# EAGLE design CLK_1_1 (EAGLE 8.3.2)
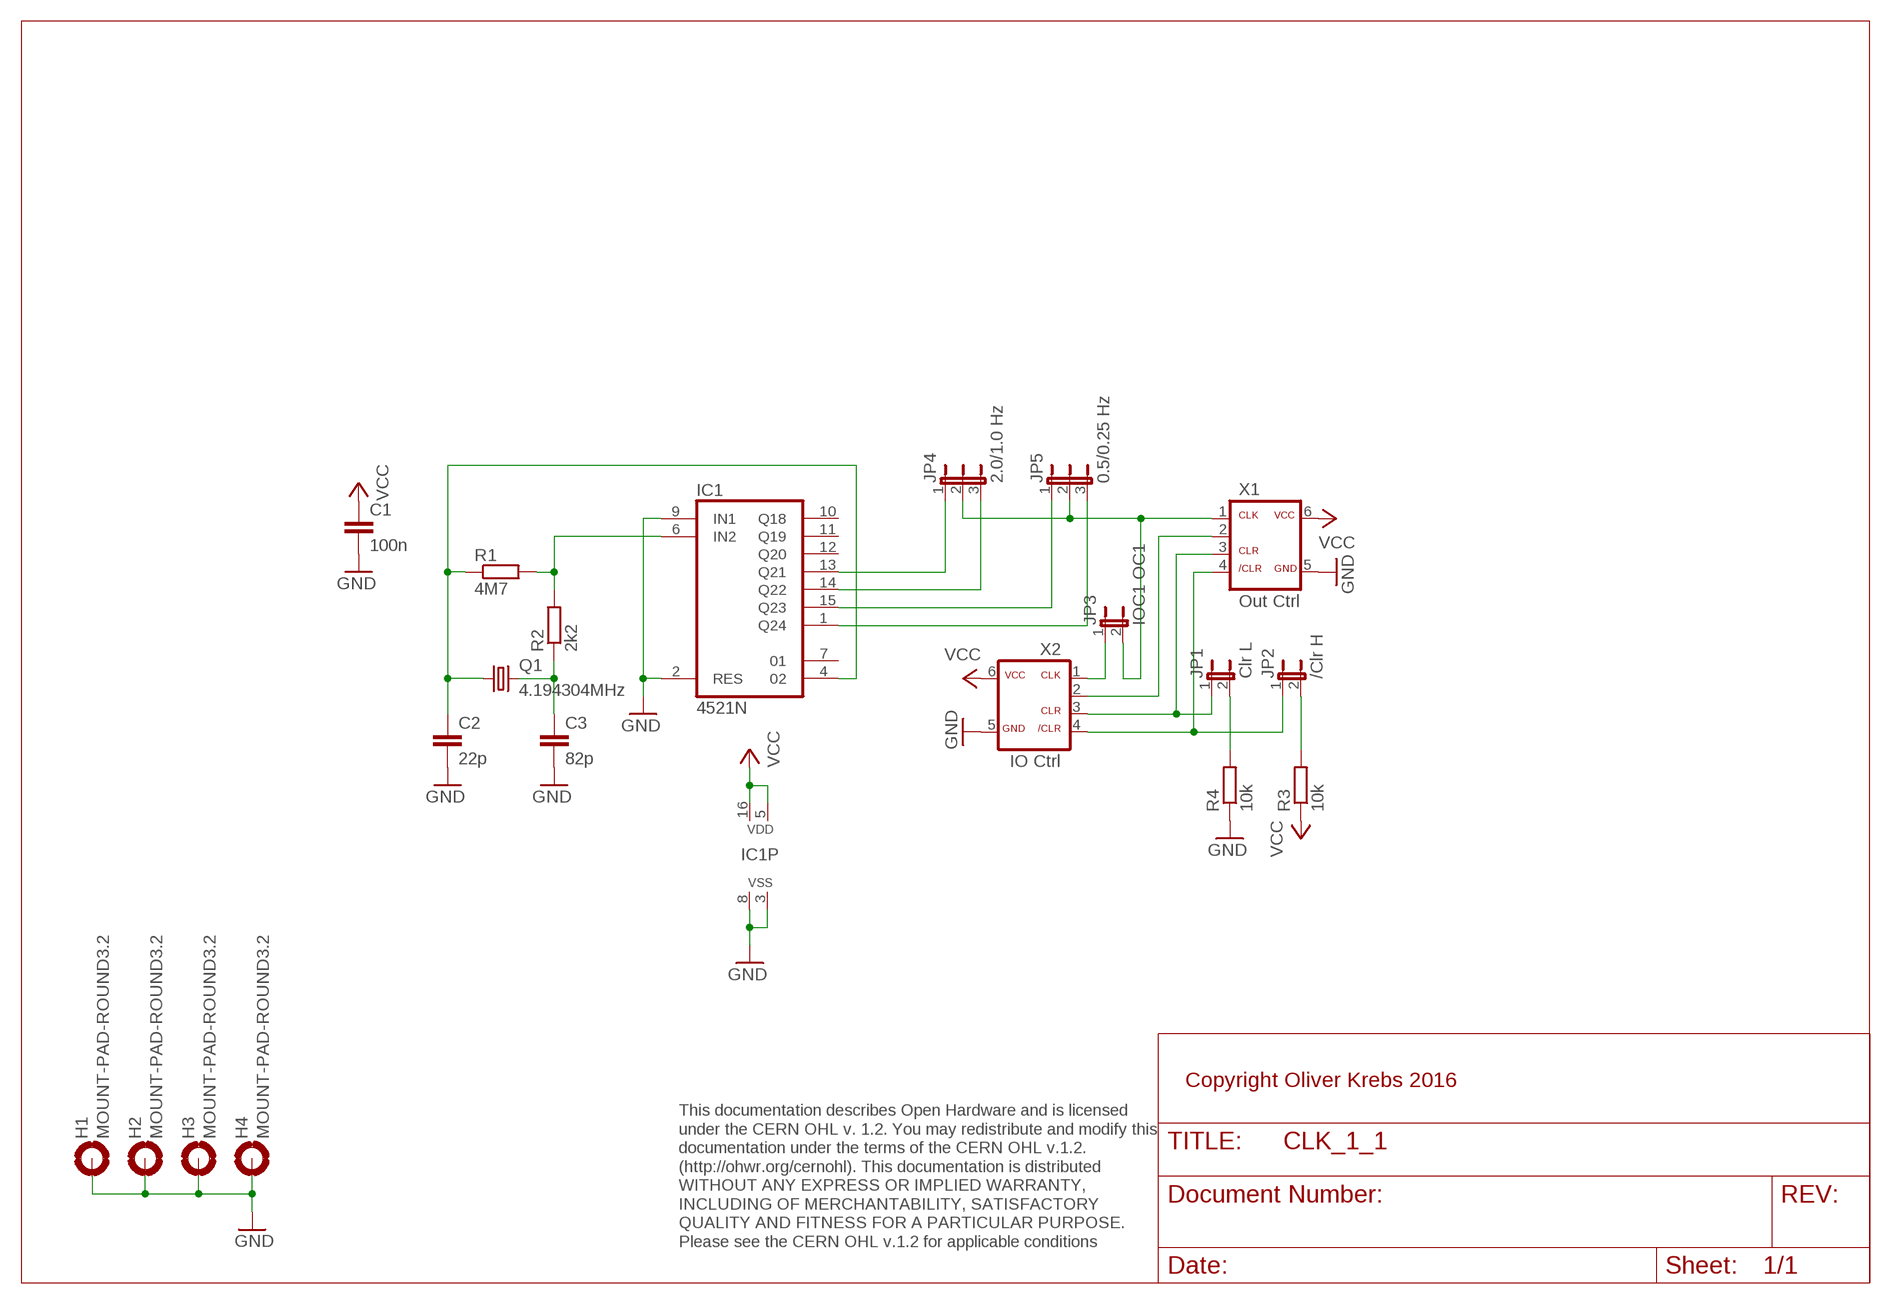
[diagram p0: schematic, sheet 1]

## Parts
C1  100n  C-EU050-025X075  [C050-025X075]
C2  22p  C-EU050-025X075  [C050-025X075]
C3  82p  C-EU050-025X075  [C050-025X075]
H1  MOUNT-PAD-ROUND3.2  [3,2-PAD]
H2  MOUNT-PAD-ROUND3.2  [3,2-PAD]
H3  MOUNT-PAD-ROUND3.2  [3,2-PAD]
H4  MOUNT-PAD-ROUND3.2  [3,2-PAD]
IC1  4521N  [DIL16]
JP1  Clr L  JP1E  [JP1]
JP2  /Clr H  JP1E  [JP1]
JP3  IOC1 OC1  JP1E  [JP1]
JP4  2.0/1.0 Hz  JP2EJP2-U  [JP2-U]
JP5  0.5/0.25 Hz  JP2EJP2-U  [JP2-U]
Q1  4.194304MHz  CRYSTALHC49US  [HC49US]
R1  4M7  R-EU_0207/10  [0207/10]
R2  2k2  R-EU_0207/10  [0207/10]
R3  10k  R-EU_0207/10  [0207/10]
R4  10k  R-EU_0207/10  [0207/10]
X1  Out Ctrl  ML6C  [ML-6]
X2  IO Ctrl  ML6C  [ML-6]

## Nets
GND: C1.2 C2.2 C3.2 H1.B3,2(MOUNT) H2.B3,2(MOUNT) H3.B3,2(MOUNT) H4.B3,2(MOUNT) IC1.2(RES) IC1.3(VSS) IC1.8(VSS) IC1.9(IN1) R4.1 X1.5 X2.5
N$1: C3.1 Q1.2 R2.1
N$2: C2.1 IC1.4 Q1.1 R1.1
N$3: IC1.6(IN2) R1.2 R2.2
N$4: IC1.14(Q22) JP4.3
N$5: IC1.13(Q21) JP4.1
N$6: IC1.15(Q23) JP5.1
N$7: IC1.1(Q24) JP5.3
N$8: JP3.2 JP4.2 JP5.2 X1.1
N$9: JP2.2 R3.2
N$10: JP1.1 X1.3 X2.3
N$11: JP2.1 X1.4 X2.4
N$12: JP1.2 R4.2
N$14: JP3.1 X2.1
VCC: C1.1 IC1.5(VDD) IC1.16(VDD) R3.1 X1.6 X2.6
X2: X1.2 X2.2
Unconnected: IC1.7 IC1.10(Q18) IC1.11(Q19) IC1.12(Q20)

## Notes on the sheet
- Copyright Oliver Krebs 2016
- This documentation describes Open Hardware and is licensed 
  under the CERN OHL v. 1.2. You may redistribute and modify this 
  documentation under the terms of the CERN OHL v.1.2. 
  (http://ohwr.org/cernohl). This documentation is distributed
  WITHOUT ANY EXPRESS OR IMPLIED WARRANTY, 
  INCLUDING OF MERCHANTABILITY, SATISFACTORY 
  QUALITY AND FITNESS FOR A PARTICULAR PURPOSE. 
  Please see the CERN OHL v.1.2 for applicable conditions

## Library data of the parts
C1-C3 = 01-my_rcl:C-EU: CAPACITOR, European symbol
H1-H4 = holes:MOUNT-PAD-ROUND: MOUNTING PAD, round
IC1 = 45xx:4521: 24-stage FREQUENCY DIVIDER new power gate with second VDD + VSS Source: http://www.standardics.nxp.com/products/hef/datasheet/hef4521b.pdf
JP1-JP3 = jumper:JP1E: JUMPER
JP4 JP5 = 01-my-jumper:JP2E: JUMPER
Q1 = SparkFun-FreqCtrl:CRYSTAL: Various standard crystals. Proven footprints.
R1-R4 = 01-my_rcl:R-EU_: RESISTOR, European symbol
X1 X2 = 01-my-con:ML6C

## Board
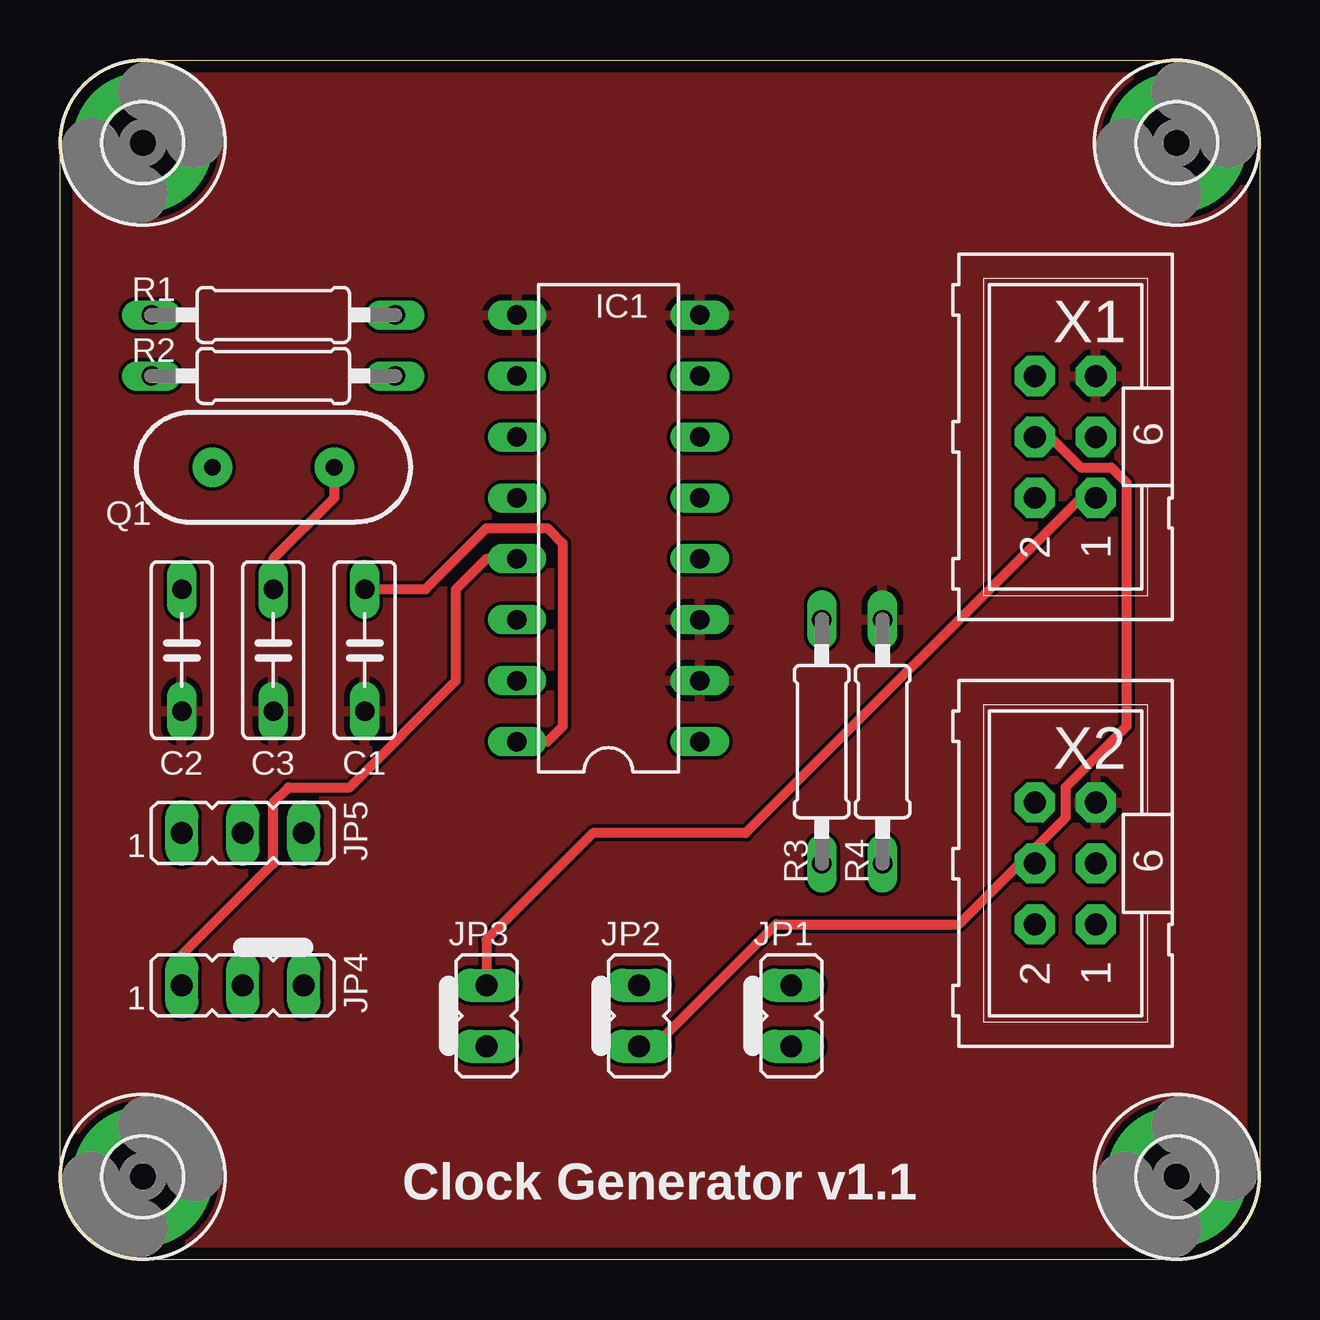
[diagram p1: board, top side]
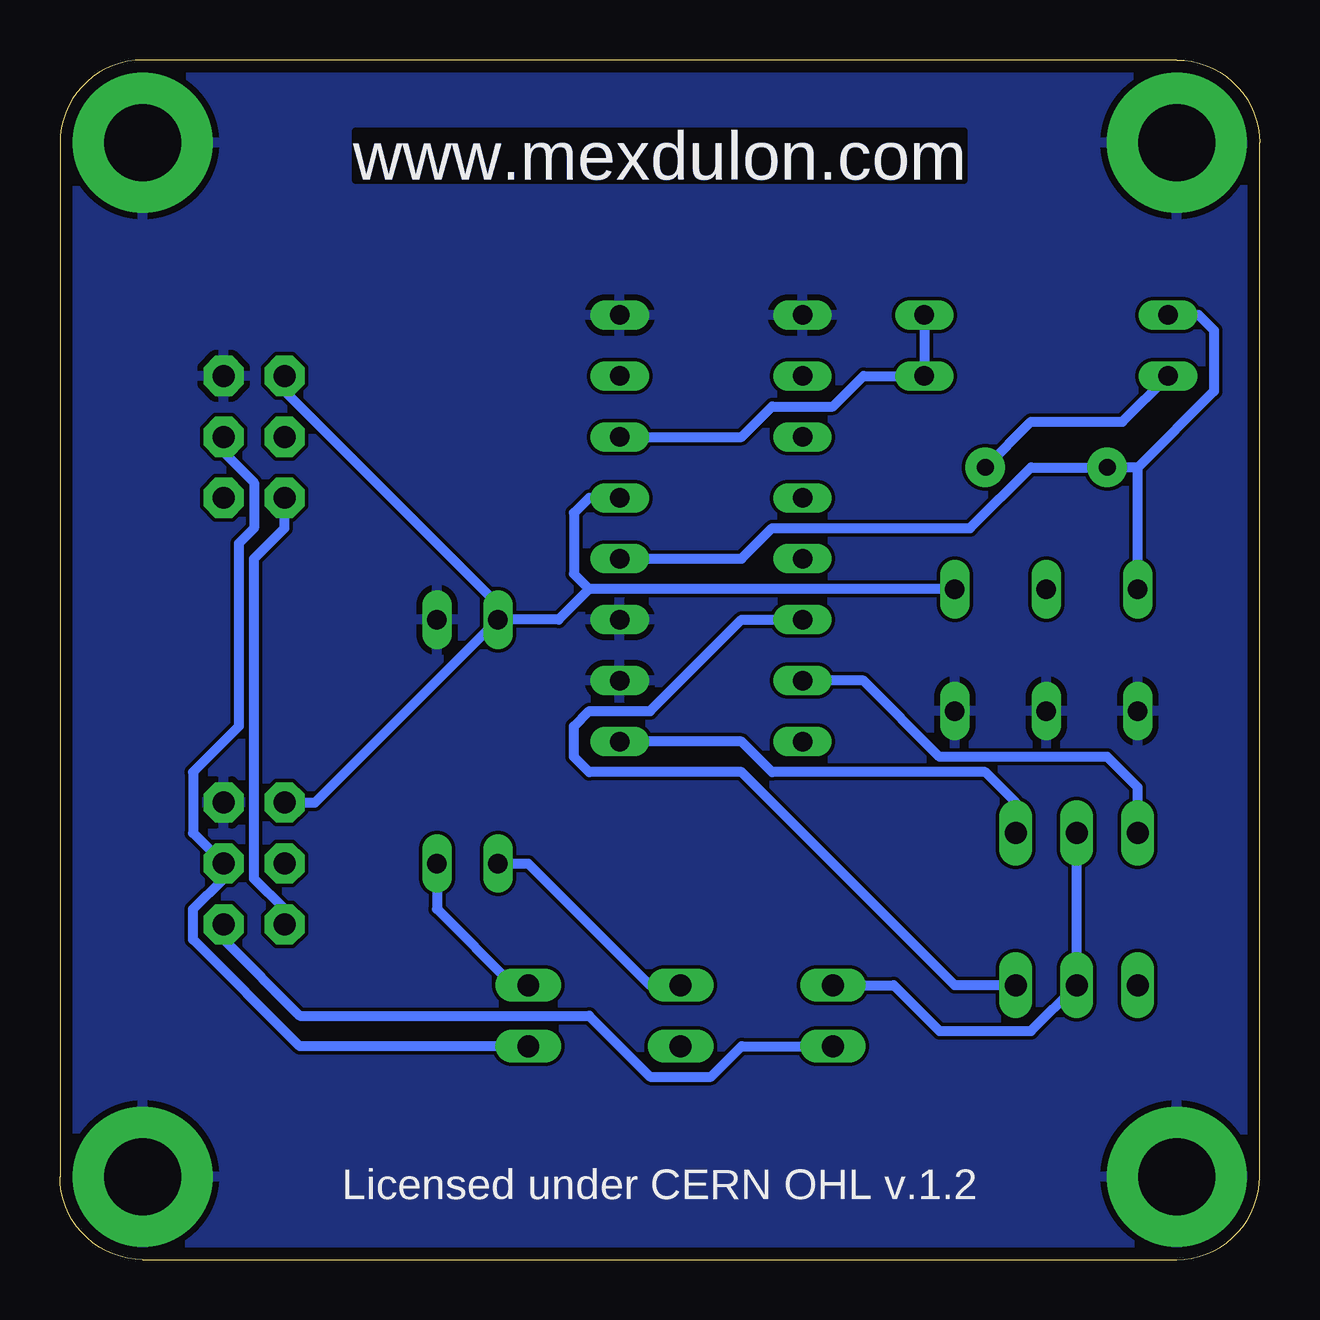
[diagram p2: board, bottom side, seen from below]

Size 50 x 50 mm. Coordinates in mm from the lower left corner, seen from the top.
Outline: 0,3.45 0,46.55 arc-90 3.45,50 46.55,50 arc-90 50,46.55 50,3.45 arc-90 46.55,0 3.45,0 arc-90 0,3.45
Copper layers (1*16): Top 0.035mm / dielectric 1.6mm / Bottom 0.035mm
Design rules "Elecrow_2-layer_PCB_eagle_rule": minimum track width 6mil, minimum drill 12mil, track to track 6mil, track to pad 6mil, pad to pad 6mil, via to via 8mil, smd to smd 0mil, copper to edge 20mil, drill to drill 10mil, minimum pad ring 6mil, minimum via ring 6mil, stop-mask expansion 0mil, vias tented up to drill 100mil, thermal gap 10mil

### Footprints (pad centres in the part's own frame; a part is rotated, then mirrored left to right if it is on the bottom)
C050-025X075 = drill 0.813 long: 1 -2.54,0; 2 2.54,0
3,2-PAD = drill 3.2 pad 5.842: B3,2 0,0
DIL16 = drill 0.813 long: 1 -8.89,-3.81; 2 -6.35,-3.81; 3 -3.81,-3.81; 4 -1.27,-3.81; 5 1.27,-3.81; 6 3.81,-3.81; 7 6.35,-3.81; 8 8.89,-3.81; 9 8.89,3.81; 10 6.35,3.81; 11 3.81,3.81; 12 1.27,3.81; 13 -1.27,3.81; 14 -3.81,3.81; 15 -6.35,3.81; 16 -8.89,3.81
JP1 = drill 0.914 long: 1 0,-1.27; 2 0,1.27
JP2-U = drill 0.914 long: 1 -2.54,0; 2 0,0; 3 2.54,0
HC49US = drill 0.7 pad 1.651: 1 -2.54,0; 2 2.54,0
0207/10 = drill 0.813 long: 1 -5.08,0; 2 5.08,0
ML-6 = drill 0.914 pad 1.676 octagon: 1 -2.54,-1.27; 2 -2.54,1.27; 3 0,-1.27; 4 0,1.27; 5 2.54,-1.27; 6 2.54,1.27

### Placement (x,y rotation side)
C1  12.7,25.4 270 top
C2  5.08,25.4 270 top
C3  8.89,25.4 270 top
H1  3.45,3.45 0 top
H2  3.45,46.55 0 top
H3  46.55,3.45 0 top
H4  46.55,46.55 0 top
IC1  22.86,30.48 90 top
JP1  30.48,10.16 0 top
JP2  24.13,10.16 0 top
JP3  17.78,10.16 0 top
JP4  7.62,11.43 0 top
JP5  7.62,17.78 0 top
Q1  8.89,33.02 0 top
R1  8.89,39.37 0 top
R2  8.89,36.83 0 top
R3  31.75,21.59 270 top
R4  34.29,21.59 270 top
X1  41.91,34.29 90 top
X2  41.91,16.51 90 top

### Tracks (layer width: path | path; a pad name or v marks a point on that pad's centre or on a via)
GND
  pour Bottom: 0,0 50.8,0 50.8,50.8 0,50.8
  pour Top: 0,50.16 50.16,50.16 50.16,0 0,0
N$1
  Top 0.406: Q1.2 11.43,31.75 8.89,29.21 C3.1
  Bottom 0.406: Q1.2 9.53,34.92 5.71,34.92 R2.1
N$2
  Bottom 0.406: IC1.4 21.59,29.21 20.32,30.48 12.06,30.48 9.53,33.02 Q1.1 5.08,33.02 | R1.1 2.54,39.37 1.91,38.73 1.91,36.2 5.08,33.02 | C2.1 5.08,33.02
N$3
  Bottom 0.406: IC1.6 21.59,34.29 20.32,35.56 17.78,35.56 16.51,36.83 R2.2 R1.2
N$4
  Bottom 0.406: JP4.3 12.7,11.43 21.59,20.32 27.94,20.32 28.57,20.95 28.57,22.23 27.94,22.86 25.4,22.86 21.59,26.67 IC1.14
N$5
  Top 0.406: JP4.1 5.08,12.7 8.89,16.51 8.89,19.05 9.53,19.68 12.06,19.68 16.51,24.13 16.51,27.94 17.78,29.21 IC1.13
N$6
  Bottom 0.406: JP5.1 5.08,19.68 6.35,20.95 13.34,20.95 16.51,24.13 IC1.15
N$7
  Bottom 0.406: JP5.3 10.16,19.05 11.43,20.32 20.32,20.32 21.59,21.59 IC1.1
N$8
  Top 0.406: X1.1 42.55,31.75 28.57,17.78 22.23,17.78 17.78,13.34 JP3.2
  Bottom 0.406: JP3.2 15.24,11.43 13.34,9.53 9.53,9.53 JP4.2 JP5.2
N$9
  Bottom 0.406: R3.2 30.48,16.51 25.4,11.43 JP2.2
N$10
  Bottom 0.406: JP1.1 40.01,8.89 44.45,13.34 44.45,14.61 43.18,15.88 X2.3 44.45,17.78 44.45,20.32 42.55,22.23 42.55,29.84 41.91,30.48 41.91,32.38 43.18,33.66 X1.3
N$11
  Top 0.406: X1.4 41.27,34.29 42.55,33.02 43.81,33.02 44.45,32.38 44.45,22.23 41.91,19.68 41.91,18.41 40.64,17.14 | 40.64,17.14 X2.4 | JP2.1 24.77,8.89 29.84,13.97 37.47,13.97 40.64,17.14
N$12
  Bottom 0.406: R4.2 34.29,14.61 31.11,11.43 JP1.2
N$14
  Bottom 0.406: X2.1 43.18,13.34 40.01,10.16 27.94,10.16 25.4,7.62 22.86,7.62 21.59,8.89 JP3.1
VCC
  Top 0.406: C1.1 15.24,27.94 17.78,30.48 20.32,30.48 20.95,29.84 20.95,22.23 20.32,21.59 IC1.16
  Bottom 0.406: C1.1 27.94,27.94 | 27.94,27.94 29.21,26.67 R3.1 | X2.6 39.37,19.05 R3.1 | X1.6 40.64,36.2 31.75,27.3 R3.1 | IC1.5 27.94,31.75 28.57,31.11 28.57,28.57 27.94,27.94
X2
  Bottom 0.406: X2.2 40.64,14.61 41.91,15.88 41.91,29.21 40.64,30.48 X1.2

### Text on the board
Bottom: www.mexdulon.com
tNames: Clock Generator v1.1
bNames: www.mexdulon.com | Licensed under CERN OHL v.1.2
tValues: OC1: Clk / OC3: Clr / OC4: /Clr / / OC2=IOC2 / OC3=IOC3 / OC4=IOC4